# EAGLE schematic XHDZ-FZ-2E (EAGLE 6.5.0)
Dummy Load XHDZ-FZ-2E
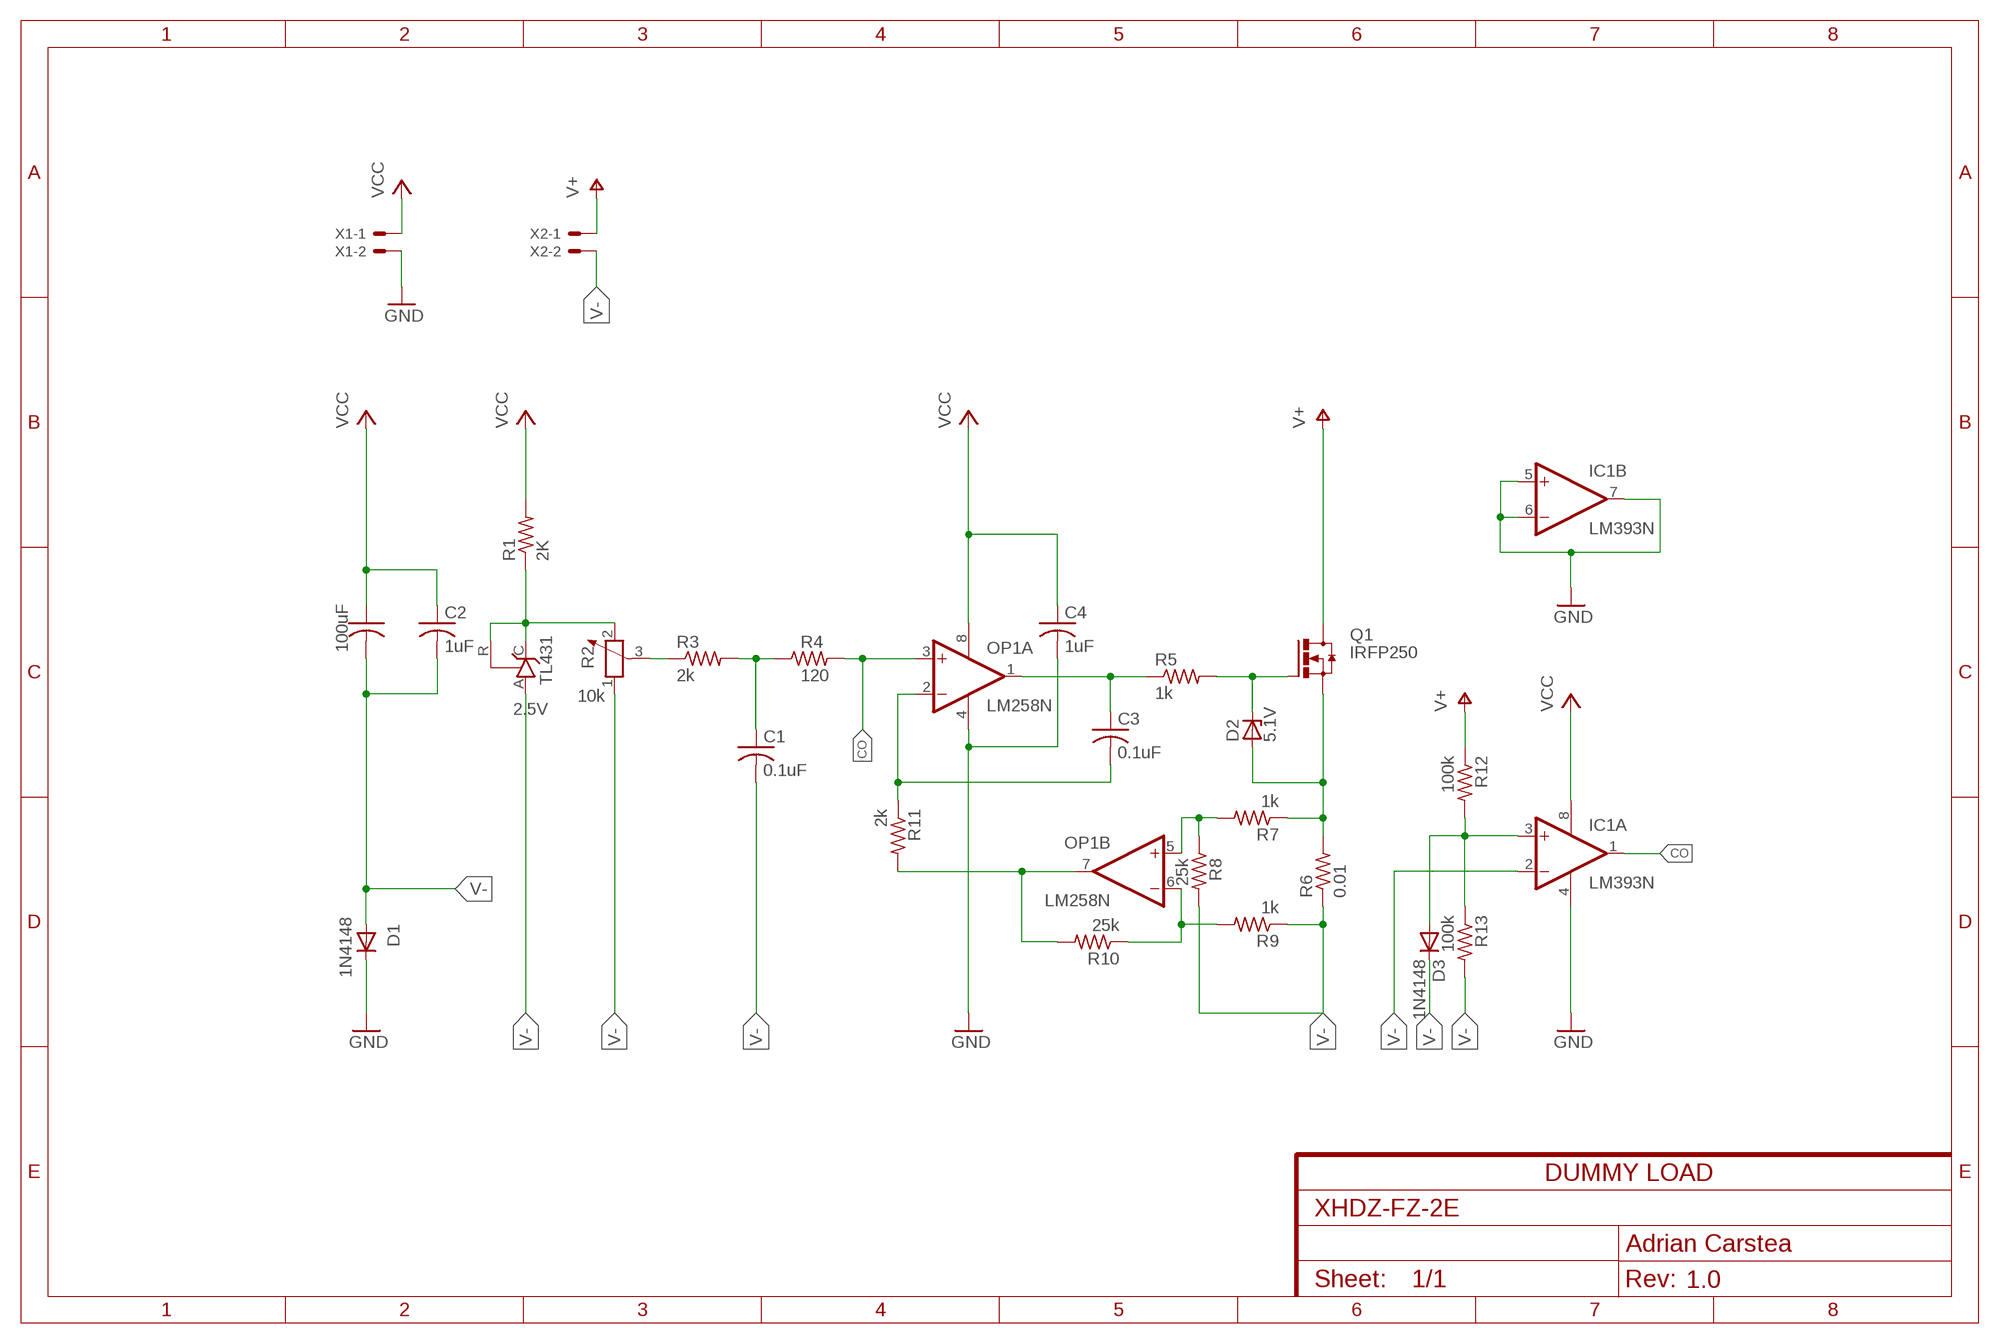
[diagram p0: schematic, sheet 1]
FRAME1 (FRAME-A4L): CNAME: DUMMY LOAD; CREVISION: 1.0; DESIGNER: Adrian Carstea

## Parts
25V  100uF  C-US025-024X044  [C025-024X044]
C1  0.1uF  C-US025-024X044  [C025-024X044]
C2  1uF  C-US025-024X044  [C025-024X044]
C3  0.1uF  C-US025-024X044  [C025-024X044]
C4  1uF  C-US025-024X044  [C025-024X044]
D1  1N4148  1N4148DO35-7  [DO35-7]
D2  5.1V  ZENER-DIODEC1702-15  [C1702-15]
D3  1N4148  1N4148DO35-7  [DO35-7]
IC1  LM393N  [DIL08]
OP1  LM258N  LM358N  [DIL08]
Q1  IRFP250  [TO-247AD-V]
R1  2K  R-US_0207/5V  [0207/5V]
R2  10k  POTENTIOMETER_PT-10  [PT-10]
R3  2k  R-US_0207/5V  [0207/5V]
R4  120  R-US_0207/5V  [0207/5V]
R5  1k  R-US_0207/5V  [0207/5V]
R6  0.01  R-US_0207/5V  [0207/5V]
R7  1k  R-US_0207/5V  [0207/5V]
R8  25k  R-US_0207/5V  [0207/5V]
R9  1k  R-US_0207/5V  [0207/5V]
R10  25k  R-US_0207/5V  [0207/5V]
R11  2k  R-US_0207/5V  [0207/5V]
R12  100k  R-US_0207/5V  [0207/5V]
R13  100k  R-US_0207/5V  [0207/5V]
TL431  2.5V  TL431CLP  [TO92-CLP]
X1  22-23-2021  [22-23-2021]
X2  22-23-2021  [22-23-2021]

## Nets
CO: IC1.1(A:OUT) OP1.3(A:+IN) R4.2
GND: C4.2 D1.C IC1.4(P:V-) IC1.5(B:+IN) IC1.6(B:-IN) IC1.7(B:OUT) OP1.4(P:V-) X1.2
N$1: R1.1 R2.2 TL431.C TL431.R
N$2: D2.A Q1.S R6.2 R7.1
N$3: R2.3 R3.1
N$4: C1.1 R3.2 R4.1
N$5: D3.A IC1.3(A:+IN) R12.2 R13.1
N$6: C3.1 OP1.1(A:OUT) R5.1
N$7: C3.2 OP1.2(A:-IN) R11.1
N$9: D2.C Q1.G R5.2
N$11: OP1.5(B:+IN) R7.2 R8.1
N$13: OP1.6(B:-IN) R9.2 R10.1
N$14: OP1.7(B:OUT) R10.2 R11.2
V+: Q1.D R12.1 X2.1
V-: 25V.2 C1.2 C2.2 D1.A D3.C IC1.2(A:-IN) R2.1 R6.1 R8.2 R9.1 R13.2 TL431.A X2.2
VCC: 25V.1 C2.1 C4.1 IC1.8(P:V+) OP1.8(P:V+) R1.2 X1.1

## Library data of the parts
25V C1-C4 = rcl:C-US: CAPACITOR, American symbol
D1 D3 = diode:1N4148: DIODE high speed (Philips)
D2 = diode:ZENER-DIODE: Z-Diode
IC1 = linear:LM393: COMPARATOR
OP1 = linear:LM358: OP AMP also LM158; LM258; LM2904 Source: http://cache.national.com/ds/LM/LM158.pdf
Q1 = transistor-power:IRFP25*: 33A/27A, 200V/150V, 0.085/0.012 Ohm, N-Channel Power MOSFET Source: Fairchild Semiconductor Corporation
R1 R3-R13 = resistor:R-US_: RESISTOR, American symbol
R2 = rcl:POTENTIOMETER_: Potentiometer
TL431 = v-reg:TL431CLP: VOLTAGE REGULATOR
X1 X2 = con-molex:22-23-2021: .100" (2.54mm) Center Header - 2 Pin; MF: MOLEX; MPN: 22-23-2021; OC_FARNELL: 1462926; OC_NEWARK: 25C3832